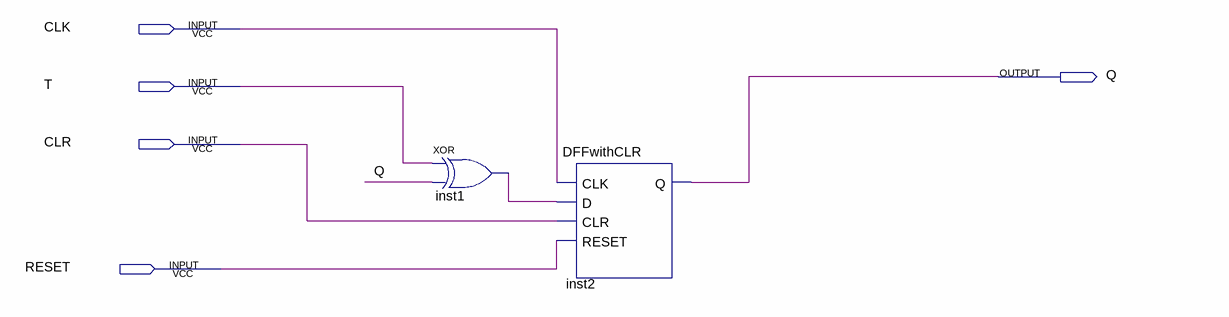
[diagram p0: schematic sheet]
// Quartus schematic TFFwithCLR.bdf as structural Verilog: 2 symbols, 5 pins
module TFFwithCLR (
  input  CLK,
  input  T,
  input  CLR,
  input  RESET,
  output Q
);

  wire inst1_out;

  xor inst1 (inst1_out, T, Q);
  DFFwithCLR inst2 (.CLK(CLK), .D(inst1_out), .CLR(CLR), .RESET(RESET), .Q(Q));
endmodule
